# Altium schematic sheet PWR-Switch.SchDoc
size B; SheetNumber: 2; SheetTotal: 17
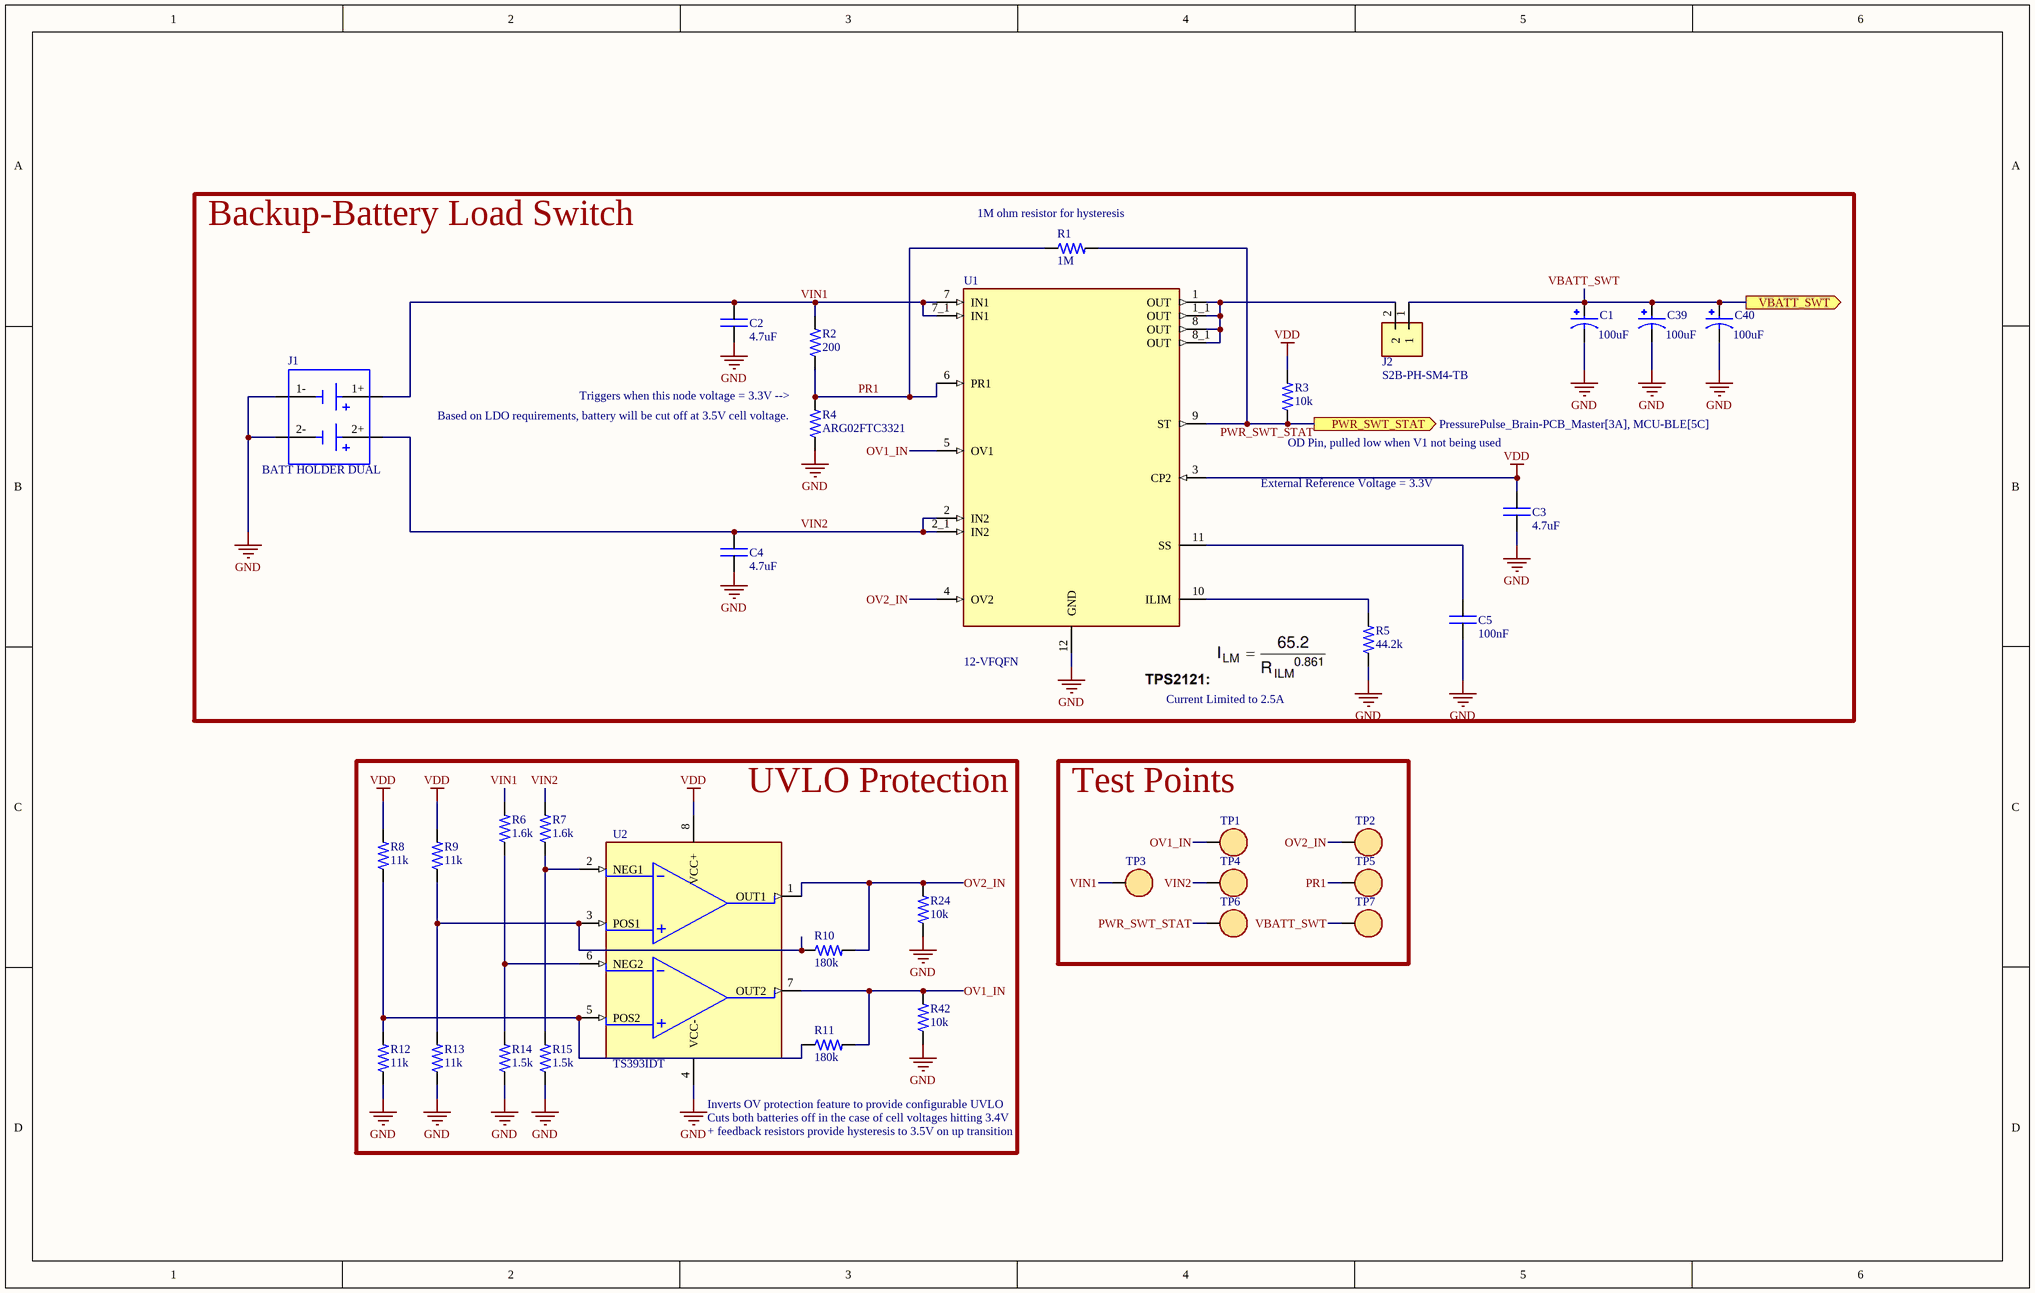
[diagram p0: PWR-Switch.SchDoc]

## Parts
C1  value 100uF  [CAP_POL_SMD]  (hidden comment: CAP POLARIZED)
C2  value 4.7uF  [0402C]  (hidden comment: CAP)
C3  value 4.7uF  [0402C]  (hidden comment: CAP)
C4  value 4.7uF  [0402C]  (hidden comment: CAP)
C5  value 100nF  [0402C]  (hidden comment: CAP)
C39  value 100uF  [CAP_POL_SMD]  (hidden comment: CAP POLARIZED)
C40  value 100uF  [CAP_POL_SMD]  (hidden comment: CAP POLARIZED)
J1  BATT HOLDER DUAL  [18650_DUAL_PARALLEL]
J2  S2B-PH-SM4-TB  [JST_PH-2POS-SMT-RA]
R1  value 1M  [0402R]  (hidden comment: RES)
R2  value 200  [0402R]  (hidden comment: RES)
R3  value 10k  [0402R]  (hidden comment: RES)
R4  value ARG02FTC3321  [0402R]  (hidden comment: RES)
R5  value 44.2k  [0402R]  (hidden comment: RES)
R6  value 1.6k  [0603-RES]  (hidden comment: RES)
R7  value 1.6k  [0603-RES]  (hidden comment: RES)
R8  value 11k  [0402R]  (hidden comment: RES)
R9  value 11k  [0402R]  (hidden comment: RES)
R10  value 180k  [0402R]  (hidden comment: RES)
R11  value 180k  [0402R]  (hidden comment: RES)
R12  value 11k  [0402R]  (hidden comment: RES)
R13  value 11k  [0402R]  (hidden comment: RES)
R14  value 1.5k  [0603-RES]  (hidden comment: RES)
R15  value 1.5k  [0603-RES]  (hidden comment: RES)
R24  value 10k  [0402R]  (hidden comment: RES)
R42  value 10k  [0402R]  (hidden comment: RES)
TP1  RH-5019  [TP - RH-5019]  (value not drawn)
TP2  RH-5019  [TP - RH-5019]  (value not drawn)
TP3  RH-5019  [TP - RH-5019]  (value not drawn)
TP4  RH-5019  [TP - RH-5019]  (value not drawn)
TP5  RH-5019  [TP - RH-5019]  (value not drawn)
TP6  RH-5019  [TP - RH-5019]  (value not drawn)
TP7  RH-5019  [TP - RH-5019]  (value not drawn)
U1  12-VFQFN  [12-VFQFN]
U2  TS393IDT  [SOIC-8]

## Blocks framed on the sheet
Backup-Battery Load Switch: C1-C5 C39 C40 J1 J2 R1-R5 U1
UVLO Protection: R6-R15 R24 R42 U2
Test Points: TP1-TP7

## Ports
PWR_SWT_STAT (out, see PressurePulse_Brain-PCB_Master[3A], MCU-BLE[5C]), VBATT_SWT (out, see PressurePulse_Brain-PCB_Master[3A], Fuel-Gauge[2B])

## Nets
GND: C1.2 C2.1 C3.1 C4.1 C5.1 C39.2 C40.2 J1.1- J1.2- R4.1 R5.1 R12.1 R13.1 R14.1 R15.1 R24.1 R42.1 U1.12(GND) U2.4(VCC-)
VDD: C3.2 R3.2 R8.2 R9.2 U1.3(CP2) U2.8(VCC+)
OV1_IN: R11.2 R42.2 TP1.1 U1.5(OV1) U2.7(OUT2)
OV2_IN: R10.2 R24.2 TP2.1 U1.4(OV2) U2.1(OUT1)
PR1: R1.1 R2.1 R4.2 TP5.1 U1.6(PR1)
PWR_SWT_STAT: R1.2 R3.1 TP6.1 U1.9(ST) ; port PWR_SWT_STAT
VBATT_SWT: C1.1 C39.1 C40.1 J2.1 TP7.1 ; port VBATT_SWT
VIN1: C2.2 J1.1+ R2.2 R6.2 TP3.1 U1.7(IN1) U1.7_1(IN1)
VIN2: C4.2 J1.2+ R7.2 TP4.1 U1.2(IN2) U1.2_1(IN2)
NetC5_2: C5.2 U1.11(SS)
NetJ2_2: J2.2 U1.1(OUT) U1.1_1(OUT) U1.8(OUT) U1.8_1(OUT)
NetR5_2: R5.2 U1.10(ILIM)
NetR6_1: R6.1 R14.2 U2.6(NEG2)
NetR7_1: R7.1 R15.2 U2.2(NEG1)
NetR8_1: R8.1 R11.1 R12.2 U2.5(POS2)
NetR9_1: R9.1 R10.1 R13.2 U2.3(POS1)

## Notes on the sheet
- (near R1) 1M ohm resistor for hysteresis
- (near R4) Based on LDO requirements, battery will be cut off at 3.5V cell voltage.
- (near R4) Triggers when this node voltage = 3.3V -->
- External Reference Voltage = 3.3V
- (near R3) OD Pin, pulled low when V1 not being used
- Current Limited to 2.5A
- Inverts OV protection feature to provide configurable UVLO
- Cuts both batteries off in the case of cell voltages hitting 3.4V
- + feedback resistors provide hysteresis to 3.5V on up transition

## Library data of the parts
C1 C39 C40 = CAP POLARIZED: MFR: PANASONIC; MFR PN: EEEHA1E101P; JLCPCB PN: C336392
C2-C4 = CAP: Capacitor; MFR: *; MFR PN: *; JLCPCB PN: *; Footprint: *
C5 = CAP: Capaicitor; MFR: *; MFR PN: *
J1 = BATT HOLDER DUAL: Battery Holder (Open) 18650 2 Cell PC Pin; MFR: MPD (Memory Protection Devices); MFR PN: BK-18650-PC4; Value: DNS; JLCPCB PN: *
J2 = JST CONN 2POS PH: Connector Header Surface Mount, Right Angle 2 position 0.079 (2.00mm); MFR PN: S2B-PH-SM4-TB(LF)(SN); MFR: JST Sales; Type: SMD; Value: S2B-PH-SM4-TB; JLCPCB PN: C295747
R1 R3 R10 R11 R24 R42 = RES: Resistor; MFR PN: *; MFR: *
  R1: JLCPCB PN: C2991630
  R3 R24 R42: JLCPCB PN: C843837
  R10 R11: JLCPCB PN: C237748
R2 R6-R9 R12-R15 = RES: Resistor; Tolerance: 0.5%; MFR PN: *; MFR: *
  R2: JLCPCB PN: C784580
  R6 R7: JLCPCB PN: C423071
  R8 R9 R12 R13: JLCPCB PN: C319901
  R14 R15: JLCPCB PN: C319982
R4 R5 = RES: Resistor; Tolerance: 1%; MFR PN: *; MFR: *
  R4: JLCPCB PN: C284517
  R5: JLCPCB PN: C25895
TP1-TP7 = TEST POINT: MFR: ronghe; MFR PN: RH-5019; Value: RH-5019; JLCPCB PN: C5199800
U1 = TPS2121RUXR: 2.7-V to 22-V, 56-ma, 4.5-A, power mux with seamless switchover; MFR: Texas Instruments; Value: TPS2121RUXR; MFR PN: TPS2121RUXR; JLCPCB PN: C485916
U2 = DUAL COMPARATOR: Micropower dual CMOS voltage comparators; MFR: STMicroelectronics; MFR PN: TS393IDT; Value: TS393IDT; JLCPCB PN: C7106